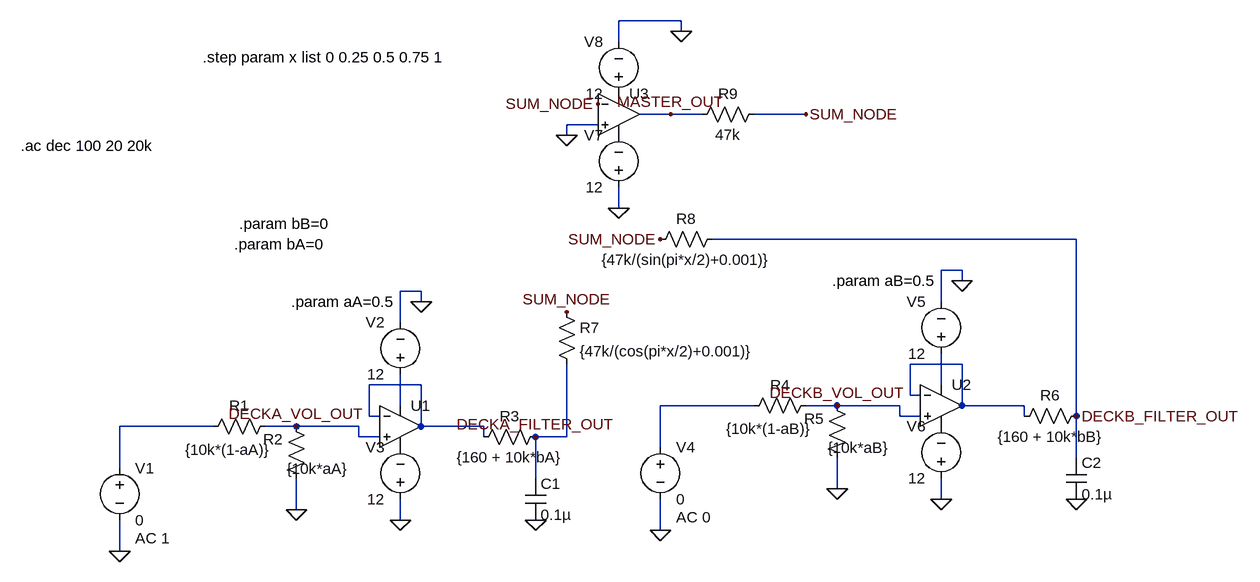
[diagram p0: schematic DJ mixing constant power.asc]
DJ mixing constant power.asc, the LTspice schematic file:
Version 4.1
SHEET 1 1360 680
WIRE 688 -720 592 -720
WIRE 688 -704 688 -720
WIRE 592 -688 592 -720
WIRE 672 -576 624 -576
WIRE 720 -576 672 -576
WIRE 880 -576 800 -576
WIRE 560 -560 512 -560
WIRE 512 -544 512 -560
WIRE 592 -432 592 -464
WIRE 1296 -384 736 -384
WIRE 1120 -336 1088 -336
WIRE 1120 -320 1120 -336
WIRE 288 -304 256 -304
WIRE 288 -288 288 -304
WIRE 1088 -288 1088 -336
WIRE 256 -256 256 -304
WIRE 1120 -192 1040 -192
WIRE 288 -160 208 -160
WIRE 1088 -160 1088 -208
WIRE 1040 -144 1040 -192
WIRE 1056 -144 1040 -144
WIRE 256 -128 256 -176
WIRE 800 -128 656 -128
WIRE 928 -128 880 -128
WIRE 1024 -128 928 -128
WIRE 1120 -128 1120 -192
WIRE 1216 -128 1120 -128
WIRE 208 -112 208 -160
WIRE 224 -112 208 -112
WIRE 1024 -112 1024 -128
WIRE 1056 -112 1024 -112
WIRE 1216 -112 1216 -128
WIRE 1296 -112 1296 -384
WIRE -32 -96 -176 -96
WIRE 96 -96 48 -96
WIRE 192 -96 96 -96
WIRE 288 -96 288 -160
WIRE 384 -96 288 -96
WIRE 192 -80 192 -96
WIRE 224 -80 192 -80
WIRE 384 -80 384 -96
WIRE 512 -80 512 -192
WIRE 512 -80 464 -80
WIRE 656 -64 656 -128
WIRE 1296 -48 1296 -112
WIRE -176 -32 -176 -96
WIRE 464 -16 464 -80
WIRE 928 0 928 -48
WIRE 1088 16 1088 -16
WIRE 96 32 96 -16
WIRE 256 48 256 16
WIRE 656 64 656 16
WIRE -176 96 -176 48
FLAG -176 96 0
FLAG 96 32 0
FLAG 96 -96 DECKA_VOL_OUT
FLAG 464 48 0
FLAG 464 -80 DECKA_FILTER_OUT
FLAG 256 48 0
FLAG 288 -288 0
FLAG 656 64 0
FLAG 928 0 0
FLAG 928 -128 DECKB_VOL_OUT
FLAG 1296 16 0
FLAG 1296 -112 DECKB_FILTER_OUT
FLAG 1088 16 0
FLAG 1120 -320 0
FLAG 512 -272 SUM_NODE
FLAG 656 -384 SUM_NODE
FLAG 560 -592 SUM_NODE
FLAG 512 -544 0
FLAG 688 -704 0
FLAG 592 -432 0
FLAG 880 -576 SUM_NODE
FLAG 672 -576 MASTER_OUT
SYMBOL voltage -176 -48 R0
WINDOW 123 24 124 Left 2
WINDOW 39 0 0 Left 0
SYMATTR InstName V1
SYMATTR Value 0
SYMATTR Value2 AC 1
SYMBOL res 64 -112 R90
WINDOW 0 0 56 VBottom 2
WINDOW 3 36 73 VTop 2
SYMATTR InstName R1
SYMATTR Value {10k*(1-aA)}
SYMBOL res 112 0 R180
WINDOW 0 36 76 Left 2
WINDOW 3 -63 31 Left 2
SYMATTR InstName R2
SYMATTR Value {10k*aA}
SYMBOL res 480 -96 R90
WINDOW 0 0 56 VBottom 2
WINDOW 3 32 56 VTop 2
SYMATTR InstName R3
SYMATTR Value {160 + 10k*bA}
SYMBOL cap 448 -16 R0
SYMATTR InstName C1
SYMATTR Value 0.1µ
SYMBOL voltage 256 -160 R180
WINDOW 0 24 96 Left 2
WINDOW 3 24 16 Left 2
WINDOW 123 0 0 Left 0
WINDOW 39 0 0 Left 0
SYMATTR InstName V2
SYMATTR Value 12
SYMBOL voltage 256 32 R180
WINDOW 0 24 96 Left 2
WINDOW 3 24 16 Left 2
WINDOW 123 0 0 Left 0
WINDOW 39 0 0 Left 0
SYMATTR InstName V3
SYMATTR Value 12
SYMBOL OpAmps\\UniversalOpAmp2 256 -96 R0
SYMATTR InstName U1
SYMBOL voltage 656 -80 R0
WINDOW 123 24 124 Left 2
WINDOW 39 0 0 Left 0
SYMATTR InstName V4
SYMATTR Value 0
SYMATTR Value2 AC 0
SYMBOL res 896 -144 R90
WINDOW 0 0 56 VBottom 2
WINDOW 3 36 73 VTop 2
SYMATTR InstName R4
SYMATTR Value {10k*(1-aB)}
SYMBOL res 944 -32 R180
WINDOW 0 36 76 Left 2
WINDOW 3 -63 31 Left 2
SYMATTR InstName R5
SYMATTR Value {10k*aB}
SYMBOL res 1312 -128 R90
WINDOW 0 0 56 VBottom 2
WINDOW 3 32 56 VTop 2
SYMATTR InstName R6
SYMATTR Value {160 + 10k*bB}
SYMBOL cap 1280 -48 R0
SYMATTR InstName C2
SYMATTR Value 0.1µ
SYMBOL voltage 1088 -192 R180
WINDOW 0 24 96 Left 2
WINDOW 3 24 16 Left 2
WINDOW 123 0 0 Left 0
WINDOW 39 0 0 Left 0
SYMATTR InstName V5
SYMATTR Value 12
SYMBOL voltage 1088 0 R180
WINDOW 0 24 96 Left 2
WINDOW 3 24 16 Left 2
WINDOW 123 0 0 Left 0
WINDOW 39 0 0 Left 0
SYMATTR InstName V6
SYMATTR Value 12
SYMBOL OpAmps\\UniversalOpAmp2 1088 -128 R0
SYMATTR InstName U2
SYMBOL res 496 -288 R0
SYMATTR InstName R7
SYMATTR Value {47k/(cos(pi*x/2)+0.001)}
SYMBOL res 752 -400 R90
WINDOW 0 0 56 VBottom 2
WINDOW 3 32 56 VTop 2
SYMATTR InstName R8
SYMATTR Value {47k/(sin(pi*x/2)+0.001)}
SYMBOL OpAmps\\UniversalOpAmp2 592 -576 R0
SYMATTR InstName U3
SYMBOL voltage 592 -448 R180
WINDOW 0 24 96 Left 2
WINDOW 3 24 16 Left 2
WINDOW 123 0 0 Left 0
WINDOW 39 0 0 Left 0
SYMATTR InstName V7
SYMATTR Value 12
SYMBOL voltage 592 -592 R180
WINDOW 0 24 96 Left 2
WINDOW 3 24 16 Left 2
WINDOW 123 0 0 Left 0
WINDOW 39 0 0 Left 0
SYMATTR InstName V8
SYMATTR Value 12
SYMBOL res 816 -592 R90
WINDOW 0 0 56 VBottom 2
WINDOW 3 32 56 VTop 2
SYMATTR InstName R9
SYMATTR Value 47k
TEXT -328 -528 Left 2 !.ac dec 100 20 20k
TEXT 88 -288 Left 2 !.param aA=0.5
TEXT 920 -320 Left 2 !.param aB=0.5
TEXT 0 -376 Left 2 !.param bA=0
TEXT 8 -408 Left 2 !.param bB=0
TEXT -48 -664 Left 2 !.step param x list 0 0.25 0.5 0.75 1

The netlist it stands for:
* DJ mixing constant power.asc
V1 N006 0 0 AC 1
R1 DECKA_VOL_OUT N006 {10k*(1-aA)}
R2 0 DECKA_VOL_OUT {10k*aA}
R3 DECKA_FILTER_OUT N002 {160 + 10k*bA}
C1 DECKA_FILTER_OUT 0 0.1µ
V2 N004 0 12
V3 0 P001 12
X§U1 DECKA_VOL_OUT N002 N004 P001 N002 level2 Avol=1Meg GBW=10Meg Slew=10Meg Ilimit=25m Rail=0 Vos=0 En=0 Enk=0 In=0 Ink=0 Rin=500Meg  ; pins In+ In- V+ V- OUT
V4 N005 0 0 AC 0
R4 DECKB_VOL_OUT N005 {10k*(1-aB)}
R5 0 DECKB_VOL_OUT {10k*aB}
R6 DECKB_FILTER_OUT N001 {160 + 10k*bB}
C2 DECKB_FILTER_OUT 0 0.1µ
V5 N003 0 12
V6 0 P002 12
X§U2 DECKB_VOL_OUT N001 N003 P002 N001 level2 Avol=1Meg GBW=10Meg Slew=10Meg Ilimit=25m Rail=0 Vos=0 En=0 Enk=0 In=0 Ink=0 Rin=500Meg  ; pins In+ In- V+ V- OUT
R7 SUM_NODE DECKA_FILTER_OUT {47k/(cos(pi*x/2)+0.001)}
R8 DECKB_FILTER_OUT SUM_NODE {47k/(sin(pi*x/2)+0.001)}
X§U3 0 SUM_NODE P003 P004 MASTER_OUT level2 Avol=1Meg GBW=10Meg Slew=10Meg Ilimit=25m Rail=0 Vos=0 En=0 Enk=0 In=0 Ink=0 Rin=500Meg  ; pins In+ In- V+ V- OUT
V7 0 P004 12
V8 P003 0 12
R9 SUM_NODE MASTER_OUT 47k
.ac dec 100 20 20k
.param aA=0.5
.param aB=0.5
.param bA=0
.param bB=0
.step param x list 0 0.25 0.5 0.75 1
.lib UniversalOpAmp2.lib
.backanno
.end